# Altium schematic sheet FYS_TMC5160_V1.1.SchDoc
size A3
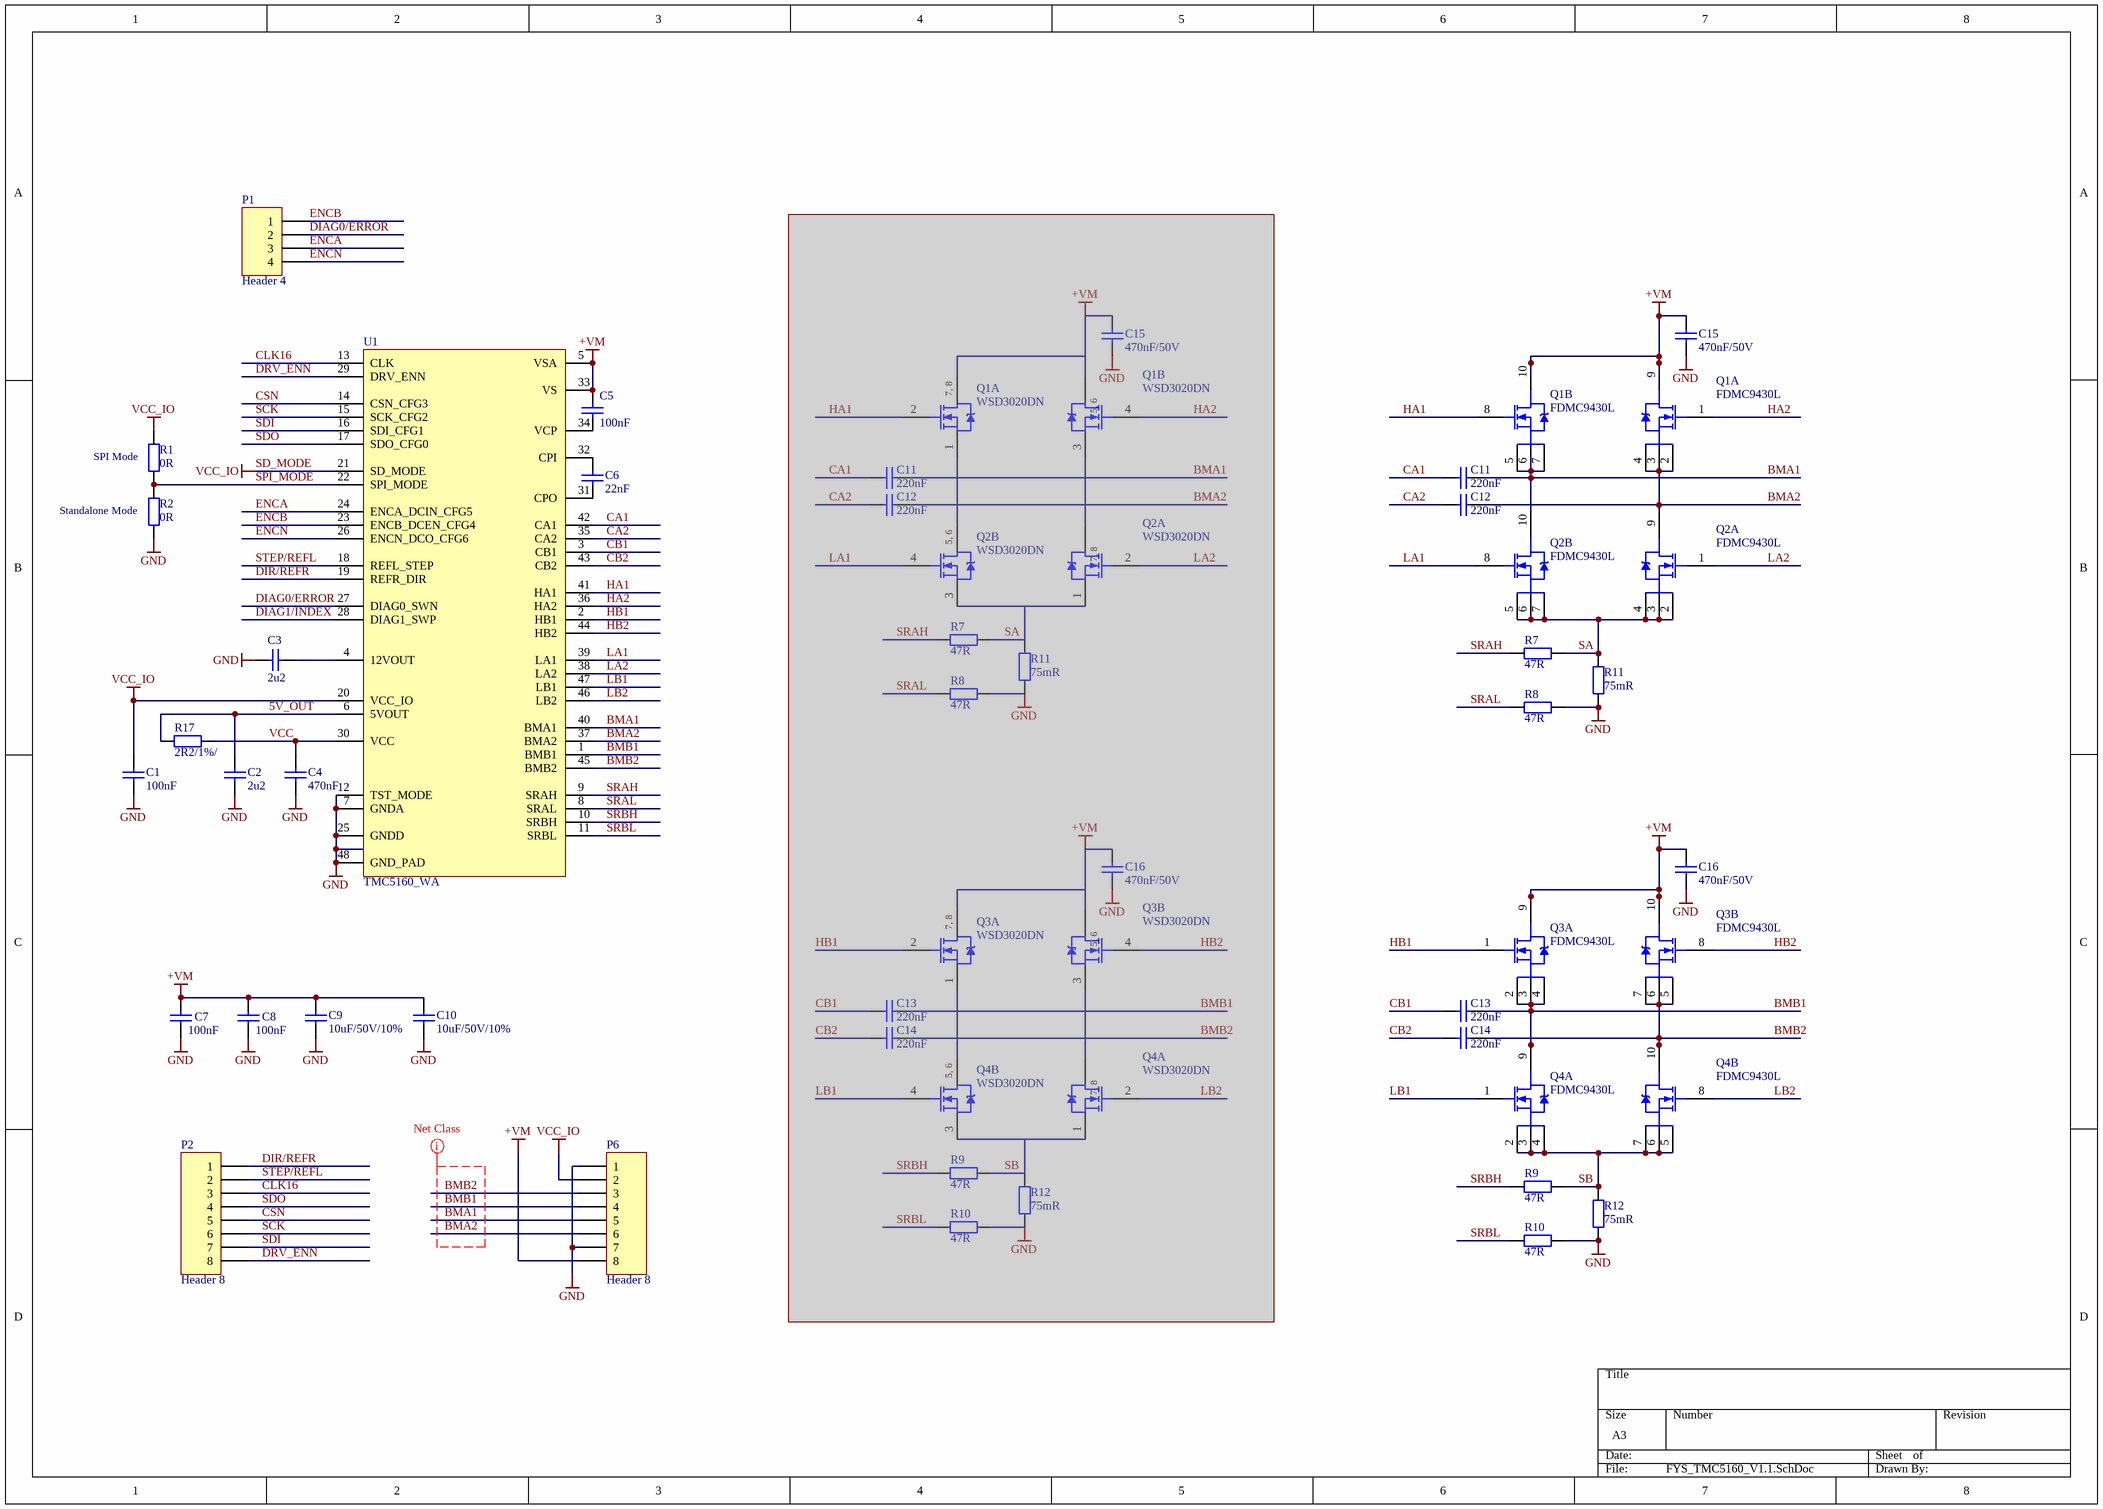
[diagram p0: FYS_TMC5160_V1.1.SchDoc]

## Parts
(Parts that share a designator on the sheet are numbered #1, #2 ... from top to bottom, then left to right.)
C1  100nF  [CAP0402_NS]
C2  2u2  [CAP0402_NS]
C3  2u2  [CAP0402_NS]
C4  470nF  [CAP0402_NS]
C5  100nF  [CAP0402_NS]
C6  22nF  [CAP0402_NS]
C7  100nF  [CAP0402_NS]
C8  100nF  [CAP0402_NS]
C9  10uF/50V/10%  [CAP0603]
C10  10uF/50V/10%  [CAP0603]
C11#1  220nF  [CAP0402_NS]  (masked out: inside a compile mask, not in the netlist)
C11#2  220nF  [CAP0402_NS]
C12#1  220nF  [CAP0402_NS]  (masked out: inside a compile mask, not in the netlist)
C12#2  220nF  [CAP0402_NS]
C13#1  220nF  [CAP0402_NS]  (masked out: inside a compile mask, not in the netlist)
C13#2  220nF  [CAP0402_NS]
C14#1  220nF  [CAP0402_NS]  (masked out: inside a compile mask, not in the netlist)
C14#2  220nF  [CAP0402_NS]
C15#1  470nF/50V  [CAP0402_NS]  (masked out: inside a compile mask, not in the netlist)
C15#2  470nF/50V  [CAP0402_NS]
C16#1  470nF/50V  [CAP0402_NS]  (masked out: inside a compile mask, not in the netlist)
C16#2  470nF/50V  [CAP0402_NS]
P1  Header 4  [HDR1X4]
P2  Header 8  [HDR1X8]
P6  Header 8  [HDR1X8]
Q1#1  WSD3020DN  [DFN3X3-8L-Dual]  (parts A,B of 2)  (masked out: inside a compile mask, not in the netlist)
Q1#2  FDMC9430L  [DFN3X3-511DG]  (parts A,B of 2)
Q2#1  WSD3020DN  [DFN3X3-8L-Dual]  (parts A,B of 2)  (masked out: inside a compile mask, not in the netlist)
Q2#2  FDMC9430L  [DFN3X3-511DG]  (parts A,B of 2)
Q3#1  WSD3020DN  [DFN3X3-8L-DUAL - AON]  (parts A,B of 2)  (masked out: inside a compile mask, not in the netlist)
Q3#2  FDMC9430L  [DFN3X3-511DG]  (parts A,B of 2)
Q4#1  WSD3020DN  [DFN3X3-8L-DUAL - AON]  (parts A,B of 2)  (masked out: inside a compile mask, not in the netlist)
Q4#2  FDMC9430L  [DFN3X3-511DG]  (parts A,B of 2)
R1  0R  [RES0402]
R2  0R  [RES0402]
R7#1  Resistance: 47R  [RES0402_NS]  (hidden comment: 47R /  / 1%)  (masked out: inside a compile mask, not in the netlist)
R7#2  Resistance: 47R  [RES0402_NS]  (hidden comment: 47R /  / 1%)
R8#1  Resistance: 47R  [RES0402_NS]  (hidden comment: 47R /  / 1%)  (masked out: inside a compile mask, not in the netlist)
R8#2  Resistance: 47R  [RES0402_NS]  (hidden comment: 47R /  / 1%)
R9#1  Resistance: 47R  [RES0402_NS]  (hidden comment: 47R /  / 1%)  (masked out: inside a compile mask, not in the netlist)
R9#2  Resistance: 47R  [RES0402_NS]  (hidden comment: 47R /  / 1%)
R10#1  Resistance: 47R  [RES0402_NS]  (hidden comment: 47R /  / 1%)  (masked out: inside a compile mask, not in the netlist)
R10#2  Resistance: 47R  [RES0402_NS]  (hidden comment: 47R /  / 1%)
R11#1  75mR  [R1206]  (masked out: inside a compile mask, not in the netlist)
R11#2  75mR  [R1206]
R12#1  75mR  [R1206]  (masked out: inside a compile mask, not in the netlist)
R12#2  75mR  [R1206]
R17  2R2/1%/  [RES0402_NS]
U1  TMC5160_WA  [QFN8x8 wettable]

## Nets
+VM: C5.1 C7.1 C8.1 C9.2 C10.2 C15#2.1 C16#2.1 P6.8 Q1#2.9(D1) Q1#2.10(D2) Q3#2.9(D1) Q3#2.10(D2) U1.5(VSA) U1.33(VS)
GND: C1.2 C2.2 C3.1 C4.2 C7.2 C8.2 C9.1 C10.1 C15#2.2 C16#2.2 P6.1 P6.7 R2.2 R8#2.1 R10#2.1 R11#2.2 R12#2.2 U1.7(GNDA) U1.12(TST_MODE) U1.25(GNDD) U1.48(GND_PAD)
SD_MODE: C1.1 P6.2 R1.1 U1.20(VCC_IO) U1.21(SD_MODE)  [also labelled VCC_IO]
5V_OUT: C2.1 R17.1 U1.6(5VOUT)
BMA1: C11#2.2 P6.5 Q1#2.5(S2) Q1#2.6(S2) Q1#2.7(S2) Q2#2.10(D2) U1.40(BMA1)
BMA2: C12#2.2 P6.6 Q1#2.2(S1) Q1#2.3(S1) Q1#2.4(S1) Q2#2.9(D1) U1.37(BMA2)
BMB1: C13#2.2 P6.4 Q3#2.2(S1) Q3#2.3(S1) Q3#2.4(S1) Q4#2.9(D1) U1.1(BMB1)
BMB2: C14#2.2 P6.3 Q3#2.5(S2) Q3#2.6(S2) Q3#2.7(S2) Q4#2.10(D2) U1.45(BMB2)
CA1: C11#2.1 U1.42(CA1)
CA2: C12#2.1 U1.35(CA2)
CB1: C13#2.1 U1.3(CB1)
CB2: C14#2.1 U1.43(CB2)
CLK16: P2.3 U1.13(CLK)
CSN: P2.5 U1.14(CSN_CFG3)
DIAG0/ERROR: P1.2 U1.27(DIAG0_SWN)
DIAG1/INDEX: U1.28(DIAG1_SWP)
DIR/REFR: P2.1 U1.19(REFR_DIR)
DRV_ENN: P2.8 U1.29(DRV_ENN)
ENCA: P1.3 U1.24(ENCA_DCIN_CFG5)
ENCB: P1.1 U1.23(ENCB_DCEN_CFG4)
ENCN: P1.4 U1.26(ENCN_DCO_CFG6)
HA1: Q1#2.8(G2) U1.41(HA1)
HA2: Q1#2.1(G1) U1.36(HA2)
HB1: Q3#2.1(G1) U1.2(HB1)
HB2: Q3#2.8(G2) U1.44(HB2)
LA1: Q2#2.8(G2) U1.39(LA1)
LA2: Q2#2.1(G1) U1.38(LA2)
LB1: Q4#2.1(G1) U1.47(LB1)
LB2: Q4#2.8(G2) U1.46(LB2)
SA: Q2#2.2(S1) Q2#2.3(S1) Q2#2.4(S1) Q2#2.5(S2) Q2#2.6(S2) Q2#2.7(S2) R7#2.1 R11#2.1
SB: Q4#2.2(S1) Q4#2.3(S1) Q4#2.4(S1) Q4#2.5(S2) Q4#2.6(S2) Q4#2.7(S2) R9#2.1 R12#2.1
SCK: P2.6 U1.15(SCK_CFG2)
SDI: P2.7 U1.16(SDI_CFG1)
SDO: P2.4 U1.17(SDO_CFG0)
SPI_MODE: R1.2 R2.1 U1.22(SPI_MODE)
SRAH: R7#2.2 U1.9(SRAH)
SRAL: R8#2.2 U1.8(SRAL)
SRBH: R9#2.2 U1.10(SRBH)
SRBL: R10#2.2 U1.11(SRBL)
STEP/REFL: P2.2 U1.18(REFL_STEP)
VCC: C4.1 R17.2 U1.30(VCC)
NetC3_2: C3.2 U1.4(12VOUT)
NetC5_2: C5.2 U1.34(VCP)
NetC6_1: C6.1 U1.31(CPO)
NetC6_2: C6.2 U1.32(CPI)

## Layout directives
net class MotorPowerOut: BMA1, BMA2, BMB1, BMB2

## Notes on the sheet
- (near R2) Standalone Mode
- (near R1) SPI Mode
- (in symbol IRF7103, part A) 7, 8
- (in symbol IRF7103, part B) 5, 6

## Library data of the parts
C1 C7 C8 = Capacitor: Ceramic capacitor; Manufacturer: Multicomp; MPN: MC0603F104M500CT; Type: MLCC; Voltage rating: 50V; ComponentLinknDescription: Datasheet; Precision: 20%; Characteristic: *; ComponentLinknURL: *; Capacitance: 100nF
C2 C3 = 2.2 µF, 25 V, ± 10%, X5R, GRM Series: SMD Multilayer Ceramic Capacitor, 0603 [1608 Metric], 2.2 µF, 25 V, ± 10%, X5R, GRM Series; MPN: GRM188R61E225KA12D; Type: MLCC; Voltage rating: 50V; ComponentLinknDescription: Datasheet; MF: MURATA; Characteristic: *; ComponentLinknURL: *; Capacitance: 2u2; Precision: 10%
C4 = Capacitor: Ceramic capacitor; MPN: MC0603X474K160CT; Type: MLCC; Voltage rating: 16V; ComponentLinknDescription: Datasheet; MF: Multicomp; Precision: 10%; Characteristic: *; ComponentLinknURL: *; Capacitance: 470nF
C5 = Capacitor: Ceramic capacitor; MPN: MC0603F104M500CT; Type: MLCC; Voltage rating: 50V; ComponentLinknDescription: Datasheet; MF: Multicomp; Precision: 20%; Characteristic: *; ComponentLinknURL: *; Capacitance: 100nF
C6 = Capacitor: Ceramic capacitor; MPN: MC0603B223K500CT; Type: MLCC; Voltage rating: 50V; ComponentLinknDescription: Datasheet; MF: Multicomp; Precision: 20%; Characteristic: *; ComponentLinknURL: *; Capacitance: 22nF
C9 C10 = 10 µF, 50 V, ± 20%, X5R, GRM Series: SMD Multilayer Ceramic Capacitor, 1206 [3216 Metric], 10 µF, 50 V, ± 20%, X5R, GRM Series; MPN: GRM31CR61H106MA12L; Type: MLCC; VoltageRating: 50V; ComponentLinknDescription: Datasheet; MF: MURATA; Capacitance: 10uF; Precision: 10%; Characteristic: *; ComponentLinknURL: *
C11#1 C11#2 C12#1 C12#2 C13#1 C13#2 C14#1 C14#2 = 0.22 µF, 50 V, ± 10%, X7R: SMD Multilayer Ceramic Capacitor, 0603 [1608 Metric], 0.22 µF, 50 V, ± 10%, X7R, GCM Series; MPN: GCM188R71H224KA64D; Type: MLCC; Voltage rating: 50V; ComponentLinknDescription: Datasheet; MF: MURATA; Characteristic: *; ComponentLinknURL: *; Capacitance: 220nF; Precision: 10%
C15#1 C15#2 = 0.47 µF, 50 V, ± 10%, X7R, C Series: SMD Multilayer Ceramic Capacitor, 0603 [1608 Metric], 0.47 µF, 50 V, ± 10%, X7R, C Series; MPN: C1608X7R1H474K080AC; Type: MLCC; VoltageRating: 50V; ComponentLinknDescription: Datasheet; MF: TDK; Capacitance: 470nF; Characteristic: *; ComponentLinknURL: *; Precision: 10%
C16#1 C16#2 = 0.47 µF, 50 V, ± 10%, X7R, C Series: SMD Multilayer Ceramic Capacitor, 0603 [1608 Metric], 0.47 µF, 50 V, ± 10%, X7R, C Series; MPN: C1608X7R1H474K080AC; Type: MLCC; ComponentLinknDescription: Datasheet; MF: TDK; Capacitance: 470nF; VoltageRating: 50V; Characteristic: *; ComponentLinknURL: *; Precision: 10%
P1 = Header 4: Header, 4-Pin; LatestRevisionDate: 17-Jul-2002; LatestRevisionNote: Re-released for DXP Platform.; Publisher: Altium Limited
P2 P6 = Header 8: Header, 8-Pin; LatestRevisionDate: 17-Jul-2002; LatestRevisionNote: Re-released for DXP Platform.; Publisher: Altium Limited
Q1#1 Q2#1 Q3#1 Q4#1 = IRF7103: HEXFET Power MOSFET; Published: 8-Jun-2000; LatestRevisionDate: 13-Apr-2006; LatestRevisionNote: IPC-7351 Footprint Added.; DatasheetVersion: Aug-1997; PackageVersion: Feb-2001; PackageReference: SO-8; Publisher: Altium Limited; PackageDescription: 8-Pin Plastic Small Outline Integrated Circuit 1.27 mm Pitch; Code_JEDEC: MS-012-AA; Code_IPC: SOIC127P600-8; ComponentLink1Description: Manufacturer Link; ComponentLink1URL: http://www.irf.com/; ComponentLink2Description: Datasheet; ComponentLink2URL: http://www.irf.com/product-info/datasheets/data/irf7103.pdf
R1 R2 = 0 ohm, 0603 [1608 Metric], 100 mW, MCWR Series: SMD Chip Resistor, Thick Film, 0 ohm, 0603 [1608 Metric], 100 mW, MCWR Series; MPN: MCWR06X000 PTL; Temp coefficient: *ppm; PowerRating: 100mW; MF: MULTICOMP; Manufacturer: *; ComponentLinknURL: *; Resistance: 0R
R7#1 R7#2 R8#1 R8#2 R9#1 R9#2 R10#1 R10#2 = 47 ohm, 75 V, 0603 [1608 Metric], 100 mW, ± 1%, MCSR 06 Series: SMD Chip Resistor, Ceramic, 47 ohm, 75 V, 0603 [1608 Metric], 100 mW, ± 1%, MCSR 06 Series; MPN: MCSR06X47R0FTL; Temp coefficient: *ppm; MF: MULTICOMP; Precision: 1%; Manufacturer: *; ComponentLinknURL: *
R11#1 R11#2 R12#1 R12#2 = R_SENS, 0.075 ohm, 1206, 1W, ± 1%, ERJ Series: SMD Chip Resistor, Thick Film, Current Sense Resistors - SMD 1W 0.075ohm 1%; MPN: ERJ-8BWFR075V; VoltageRating: 50V; Temp coefficient: *ppm; MF: Panasonic Electronic Components; Precision: 1%; PowerRating: 1W; Resistance: 75mR
R17 = Resistor: MPN: MC0063W060312R2; Precision: 1%; Voltage rating: *V; Temp coefficient: *ppm; Power rating: *mW; ComponentLinknDescription: Datasheet; Resistance: 2R2; MF: Multicomp; ComponentLinknURL: *